# EAGLE design ThingShield_Bare (EAGLE 6.6.0)
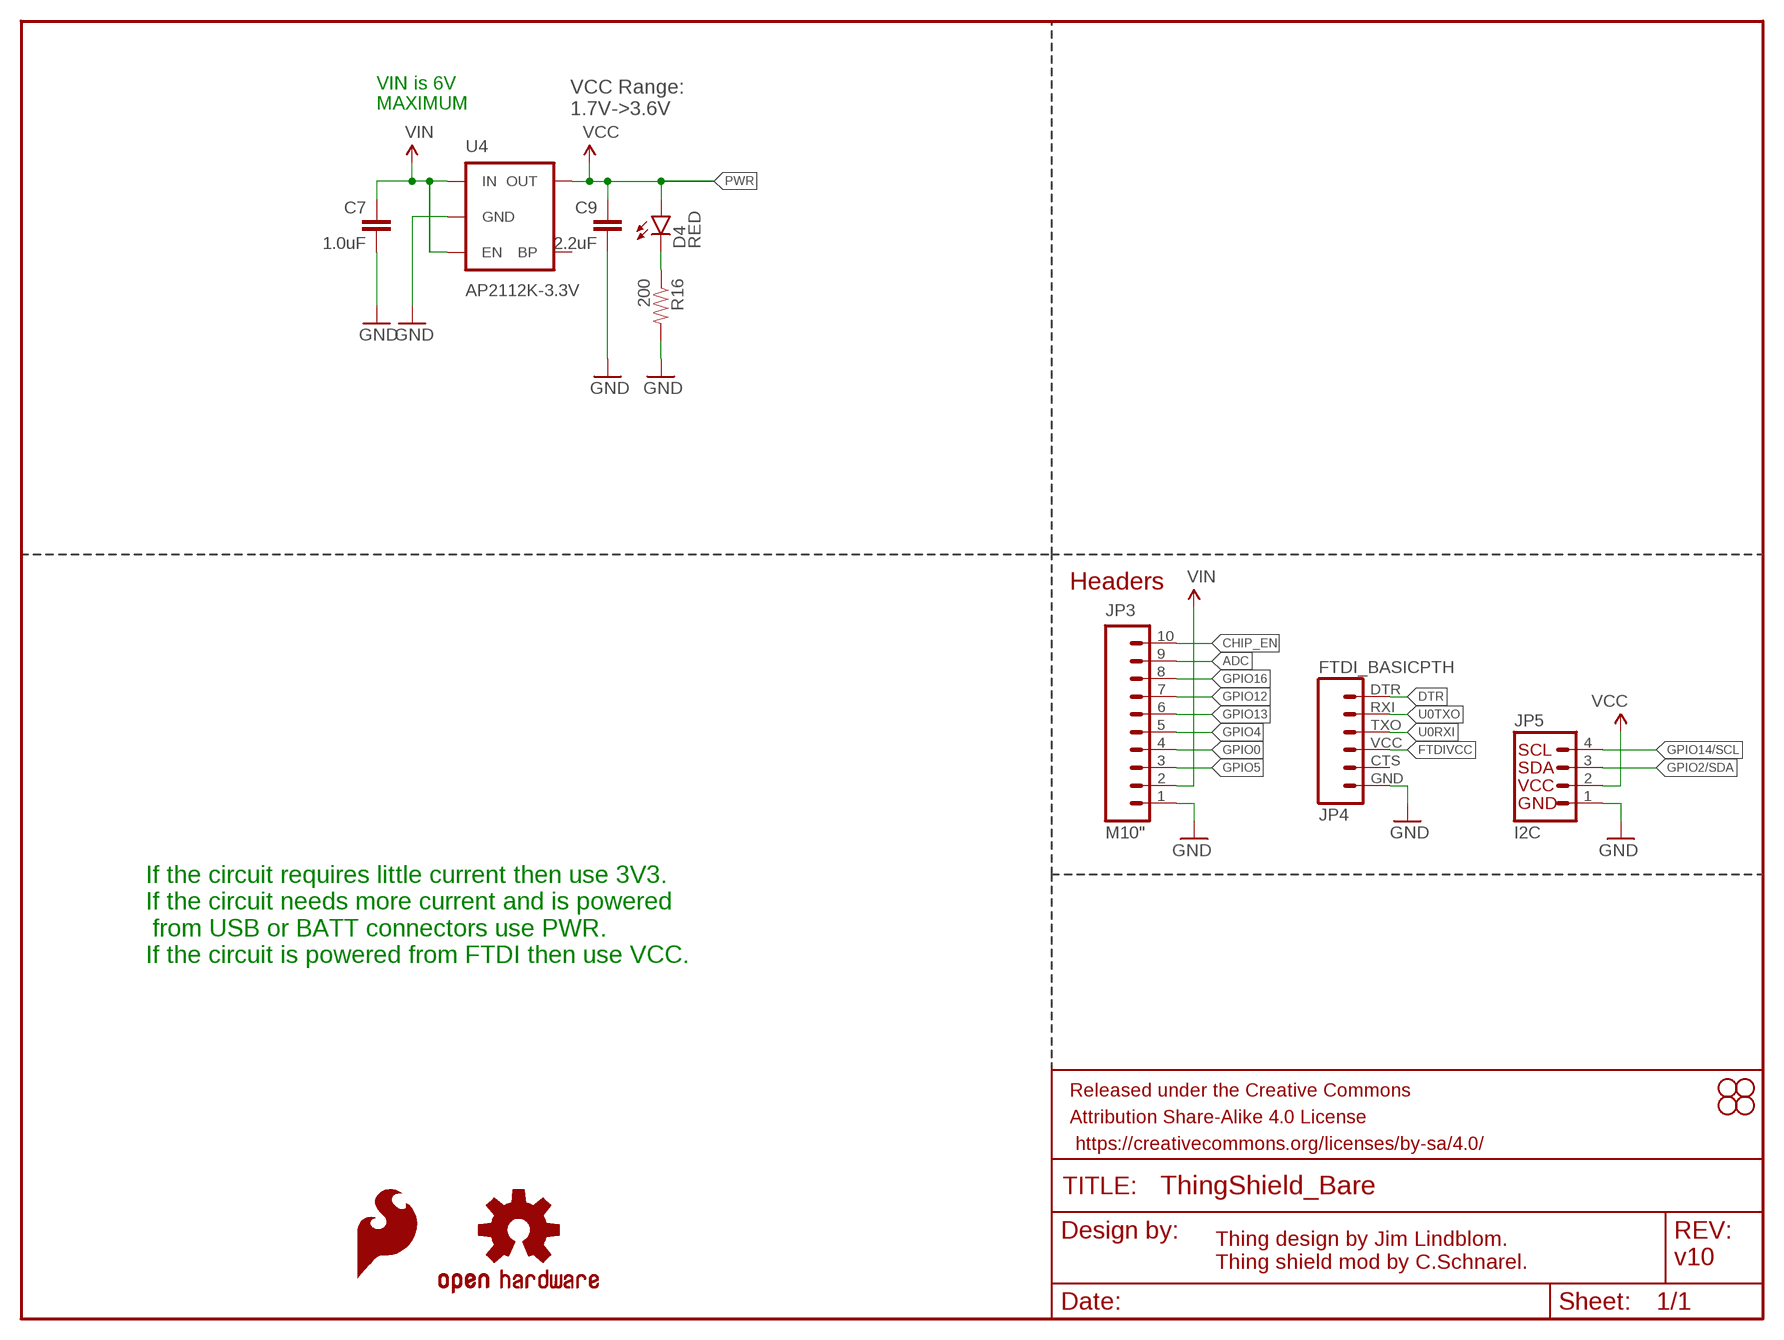
[diagram p0: schematic, sheet 1]

## Parts
C7  1.0uF  1.0UF-25V-+80/-20(0805)  [0805]
C9  2.2uF  2.2UF-10V-20%(0603)  [0603-CAP]
D4  RED  LED-RED0603  [LED-0603]
FRAME1  FRAME-LETTER  [CREATIVE_COMMONS]
JP3  M10"  [1X10]
JP4  FTDI_BASICPTH  [FTDI_BASIC]
JP5  I2C  I2C_STANDARD  [1X04]
LOGO3  SFE_LOGO_FLAME.1_INCH  [SFE_LOGO_FLAME_.1]
LOGO4  OSHW-LOGOS  [OSHW-LOGO-S]
R16  200  200OHM1/10W1%(0603)  [0603-RES]
STANDOFF1  STAND-OFF  [STAND-OFF]
STANDOFF2  STAND-OFF  [STAND-OFF]
STANDOFF3  STAND-OFF  [STAND-OFF]
STANDOFF4  STAND-OFF  [STAND-OFF]
U4  AP2112K-3.3V  V_REG_LDOSMD  [SOT23-5]

## Nets
ADC: JP3.9
CHIP_EN: JP3.10
DTR: JP4.DTR
FTDIVCC: JP4.VCC
GND: C7.2 C9.2 JP3.1 JP4.GND JP5.1 R16.2 U4.2(GND)
GPIO0: JP3.4
GPIO2/SDA: JP5.3
GPIO4: JP3.5
GPIO5: JP3.3
GPIO12: JP3.7
GPIO13: JP3.6
GPIO14/SCL: JP5.4
GPIO16: JP3.8
N$4: D4.C R16.1
PWR: C9.1 D4.A U4.5(OUT) ; supply symbol labelled VCC
U0RXI: JP4.TXO
U0TXO: JP4.RXI
VCC: JP5.2
VIN: C7.1 JP3.2 U4.1(IN) U4.3(EN)
Unconnected: JP4.CTS U4.4(BP)

## Notes on the sheet
- VIN is 6V
  MAXIMUM
- VCC Range:
  1.7V->3.6V
- Headers
- If the circuit requires little current then use 3V3.
  If the circuit needs more current and is powered
   from USB or BATT connectors use PWR.
  If the circuit is powered from FTDI then use VCC.
- v10
- Thing design by Jim Lindblom. 
  Thing shield mod by C.Schnarel.

## Library data of the parts
C7 = SparkFun-Capacitors:1.0UF-25V-+80/-20(0805): CAP-11625; PROD_ID: CAP-11625
C9 = SparkFun-Capacitors:2.2UF-10V-20%(0603): CAP-07888; PROD_ID: CAP-07888
D4 = SparkFun-LED:LED-RED: Assorted Red LEDs LilyPad 1206- DIO-09912 1206- DIO-00809 0603- DIO-00819; PROD_ID: DIO-00819
FRAME1 = SparkFun-Aesthetics:FRAME-LETTER: Schematic Frame Standard 8.5x11 US Letter frame
JP3 = SparkFun-Connectors:M10: Header 10 Standard 10-pin 0.1" header. Use with straight break away headers (SKU : PRT-00116), right angle break away headers (PRT-00553), swiss pins (PRT-00743), machine pins (PRT-00117), and female headers (PRT-00115).
JP4 = SparkFun-Connectors:FTDI_BASIC: FTDI Basic header with labels
JP5 = SparkFun-Connectors:I2C_STANDARD: SparkFun has standardized on a pinout for all I2C based sensor breakouts. This pinout allows I2C boards to be plugged directly into the headers on Arduino Uno compatible boards, and to be daisy chained easily.
LOGO3 = SparkFun-Aesthetics:SFE_LOGO_FLAME: SFE Logo, flame only This is the SparkFun flame logo. The logo on the schematic will always be the same size; the package variant is the height of the flame. Default layer for the logo on the board is tSilk.
LOGO4 = SparkFun-Aesthetics:OSHW-LOGO: Open Source Hardware Logo This logo indicates the piece of hardware it is found on incorporates a OSHW license and/or adheres to the definition of open source hardware found here: http://freedomdefined.org/OSHW
R16 = SparkFun-Resistors:200OHM1/10W1%(0603): RES-08220; PROD_ID: RES-08220
STANDOFF1-STANDOFF4 = SparkFun-Electromechanical:STAND-OFF: #4 Stand Off This is the mechanical footprint for a #4 phillips button head screw. Use the keepout ring to avoid running the screw head into surrounding components. SKU : PRT-00447
U4 = SparkFun-PowerIC:V_REG_LDO: Voltage Regulator LDO Standard 150mA LDO voltage regulator in SOT-23 layout. Micrel part MIC5205. BP (by-pass) pin is used to lower output noise with 470pF cap.; PROD_ID: VREG-12457

## Board
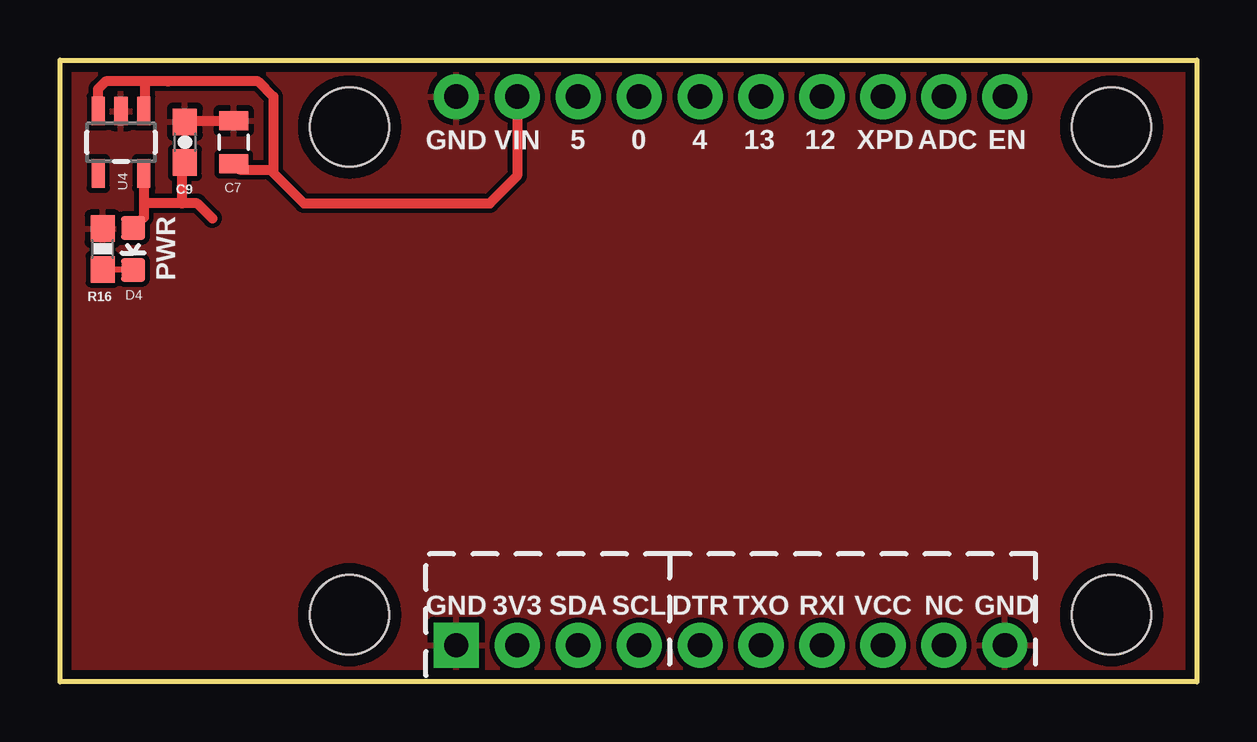
[diagram p1: board, top side]
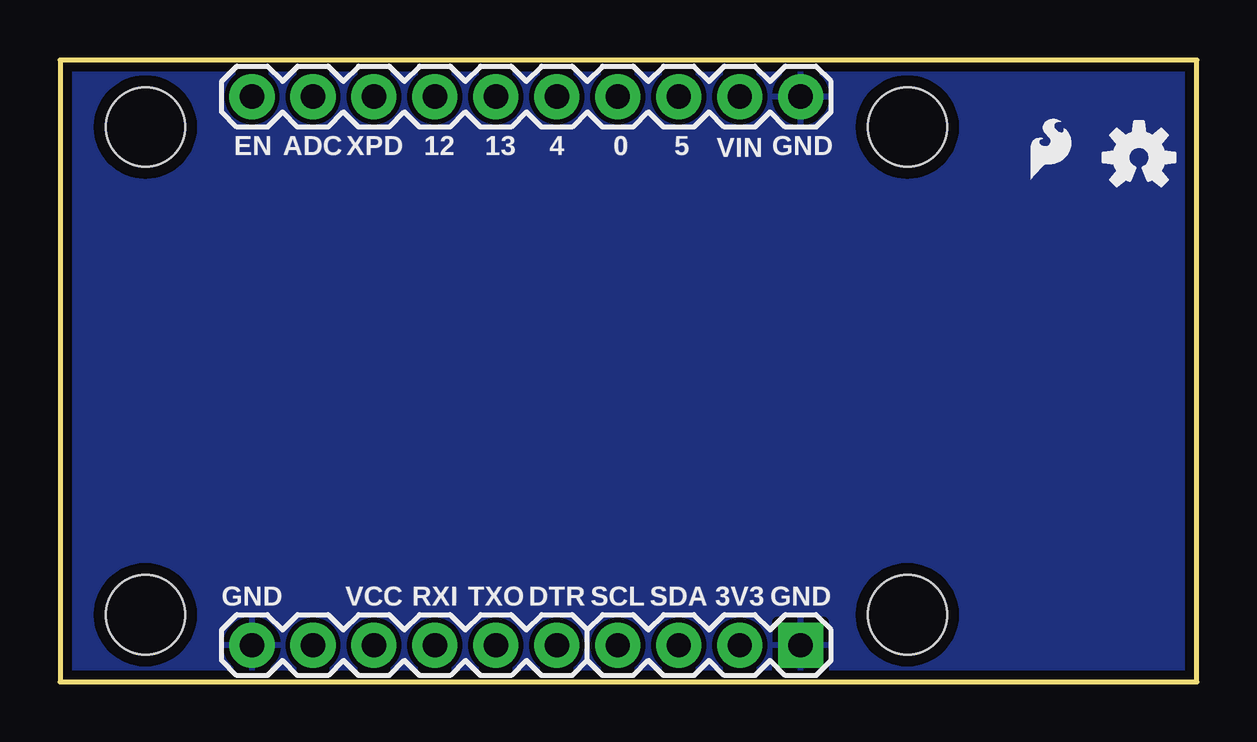
[diagram p2: board, bottom side, seen from below]

Size 47.37 x 25.91 mm. Coordinates in mm from the lower left corner, seen from the top.
Outline: 0,0 0,25.91 47.37,25.91 47.37,0 0,0
Copper layers (1*16): Top 0.0356mm / dielectric 1.5011mm / Bottom 0.0356mm
Design rules "LaenPCBOrder": minimum track width 6mil, minimum drill 13mil, track to track 6mil, track to pad 6mil, pad to pad 6mil, via to via 6mil, smd to smd 6mil, copper to edge 15mil, drill to drill 6mil, minimum pad ring 7mil, minimum via ring 7mil, stop-mask expansion 4mil, vias tented up to drill 0mil, thermal gap 10mil

### Footprints (pad centres in the part's own frame; a part is rotated, then mirrored left to right if it is on the bottom)
0805 = smd 0.8 x 1.2: 1 -0.9,0; 2 0.9,0
0603-CAP = smd 1.1 x 1: 1 -0.85,0; 2 0.85,0
LED-0603 = smd 1 x 1: A 0,-0.877; C 0,0.877
1X10 = drill 1.016 pad 1.88: 1 0,0; 2 2.54,0; 3 5.08,0; 4 7.62,0; 5 10.16,0; 6 12.7,0; 7 15.24,0; 8 17.78,0; 9 20.32,0; 10 22.86,0
FTDI_BASIC = drill 1.016 pad 1.88: CTS 10.16,0; DTR 0,0; GND 12.7,0; RXI 2.54,0; TXO 5.08,0; VCC 7.62,0
1X04 = drill 1.016 pad 1.88 square: 1 0,0 | drill 1.016 pad 1.88: 2 2.54,0; 3 5.08,0; 4 7.62,0
0603-RES = smd 1.1 x 1: 1 -0.85,0; 2 0.85,0
STAND-OFF = hole 3.302: 0,0
SOT23-5 = smd 0.55 x 1.2: 1 -0.95,-1.3; 2 0,-1.3; 3 0.95,-1.3; 4 0.95,1.3; 5 -0.95,1.3

### Placement (x,y rotation side)
C7  7.24,22.48 90 top
C9  5.21,22.48 90 top
D4  3.05,18.03 180 top
FRAME1  -2.03,-18.29 0 top  (outside the outline)
JP3  16.51,24.38 180 bottom
JP4  26.67,1.52 180 bottom
JP5  16.51,1.52 180 bottom
LOGO3  7.24,20.57 0 bottom
LOGO4  2.41,21.84 0 bottom
R16  1.78,18.03 90 top
STANDOFF1  43.81,23.11 0 top
STANDOFF2  43.81,2.79 0 top
STANDOFF3  12.06,23.11 0 top
STANDOFF4  12.06,2.79 0 top
U4  2.54,22.48 180 top

### Tracks (layer width: path | path; a pad name or v marks a point on that pad's centre or on a via)
GND
  Top 0.406: C9.2 5.26,23.38 C7.2
  pour Top (isolate 0.203, rank 6): 0,25.91 0,0 47.37,0 47.37,25.91
  pour Bottom (isolate 0.203): 0,25.91 0,0 47.37,0 47.37,25.91
N$4
  Top 0.254: R16.1 3.02,17.18 D4.C
PWR
  Top 0.406: U4.5 3.49,19.94 | 3.49,19.94 3.49,19.35 D4.A | 5.08,19.94 5.71,19.94 6.35,19.3 | 5.08,19.94 3.49,19.94 | C9.1 5.08,21.5 5.08,19.94
VIN
  Top 0.406: 3.56,25.03 4.5,25.02 8.26,25.02 8.89,24.38 8.89,21.34 | 3.56,25.03 1.91,25.02 1.59,24.7 U4.3 | 8.89,21.34 8.89,21.21 10.16,19.94 17.91,19.94 19.05,21.08 JP3.2 | U4.1 3.56,23.85 3.56,25.03 | C7.1 7.48,21.34 8.89,21.34

### Text on the board
tPlace: GND | VIN | 5 | 0 | 4 | 13 | 12 | XPD | ADC | EN | PWR | GND | 3V3 | SDA | SCL | DTR | TXO | RXI | VCC | NC | GND
bPlace: GND | VIN | 5 | 0 | 4 | 13 | 12 | XPD | ADC | EN | GND | 3V3 | SDA | SCL | DTR | TXO | RXI | VCC | GND
tDocu: If the circuit requires little current then use 3V3. / If the circuit needs more current and is powered from USB or BATT connectors use PWR. / If the circuit is powered from FTDI then use VCC. | Jim Lindblom